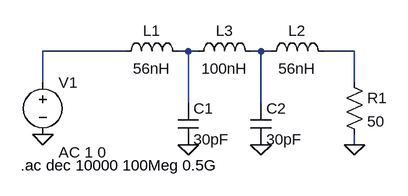
[diagram p0: schematic Ausgangsfilter.asc]
Ausgangsfilter.asc, the LTspice schematic file:
Version 4
SHEET 1 880 680
WIRE 64 112 -64 112
WIRE 160 112 144 112
WIRE 176 112 160 112
WIRE 272 112 256 112
WIRE 288 112 272 112
WIRE 416 112 368 112
WIRE -64 160 -64 112
WIRE 416 160 416 112
WIRE 160 192 160 112
WIRE 272 192 272 112
WIRE 416 256 416 240
FLAG -64 240 0
FLAG 160 256 0
FLAG 272 256 0
FLAG 416 256 0
SYMBOL voltage -64 144 R0
WINDOW 123 24 124 Left 2
WINDOW 39 0 0 Left 2
SYMATTR InstName V1
SYMATTR Value ""
SYMATTR Value2 AC 1 0
SYMBOL ind 48 128 R270
WINDOW 0 32 56 VTop 2
WINDOW 3 5 56 VBottom 2
SYMATTR InstName L1
SYMATTR Value 56nH
SYMATTR SpiceLine Ipk=1 Rser=0.095
SYMBOL cap 144 192 R0
SYMATTR InstName C1
SYMATTR Value 30pF
SYMATTR SpiceLine V=50
SYMBOL ind 272 128 R270
WINDOW 0 32 56 VTop 2
WINDOW 3 5 56 VBottom 2
SYMATTR InstName L2
SYMATTR Value 56nH
SYMATTR SpiceLine Ipk=1 Rser=0.095
SYMBOL ind 160 128 R270
WINDOW 0 32 56 VTop 2
WINDOW 3 5 56 VBottom 2
SYMATTR InstName L3
SYMATTR Value 100nH
SYMATTR SpiceLine Ipk=1 Rser=0.16
SYMBOL cap 256 192 R0
SYMATTR InstName C2
SYMATTR Value 30pF
SYMATTR SpiceLine V=50
SYMBOL res 400 144 R0
SYMATTR InstName R1
SYMATTR Value 50
TEXT -98 288 Left 2 !.ac dec 10000 100Meg 0.5G

The netlist it stands for:
* Ausgangsfilter.asc
V1 N001 0 AC 1 0
L1 N001 N002 56nH Ipk=1 Rser=0.095
C1 N002 0 30pF V=50
L2 N003 N004 56nH Ipk=1 Rser=0.095
L3 N002 N003 100nH Ipk=1 Rser=0.16
C2 N003 0 30pF V=50
R1 N004 0 50
.ac dec 10000 100Meg 0.5G
.backanno
.end